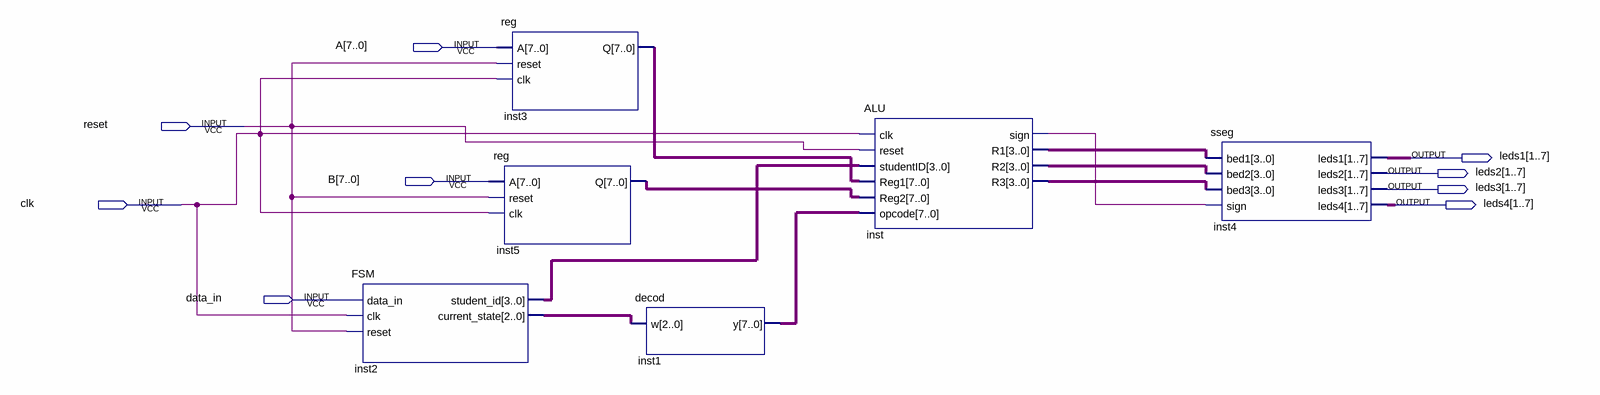
[diagram p0: schematic sheet]
// Quartus schematic lab_6.bdf as structural Verilog: 6 symbols, 9 pins
module lab_6 (
  input  [7:0] A,
  input  reset,
  input  [7:0] B,
  input  clk,
  input  data_in,
  output [1:7] leds1,
  output [1:7] leds2,
  output [1:7] leds3,
  output [1:7] leds4
);

  wire inst_sign;
  wire [2:0] inst2_current_state;
  wire [3:0] inst2_student_id, inst_r1, inst_r2, inst_r3;
  wire [7:0] inst1_y, inst3_q, inst5_q;

  FSM inst2 (
    .data_in(data_in), .clk(clk), .reset(reset), .student_id(inst2_student_id),
    .current_state(inst2_current_state));
  \reg  inst3 (.A(A), .reset(reset), .clk(clk), .Q(inst3_q));
  \reg  inst5 (.A(B), .reset(reset), .clk(clk), .Q(inst5_q));
  decod inst1 (.w(inst2_current_state), .y(inst1_y));
  ALU inst (
    .clk(clk), .reset(reset), .studentID(inst2_student_id), .Reg1(inst3_q), .Reg2(inst5_q), .opcode(inst1_y),
    .sign(inst_sign), .R1(inst_r1), .R2(inst_r2), .R3(inst_r3));
  sseg inst4 (
    .bed1(inst_r1), .bed2(inst_r2), .bed3(inst_r3), .sign(inst_sign), .leds1(leds1), .leds2(leds2),
    .leds3(leds3), .leds4(leds4));
endmodule
